# Altium project BTConnecter.PrjPcb
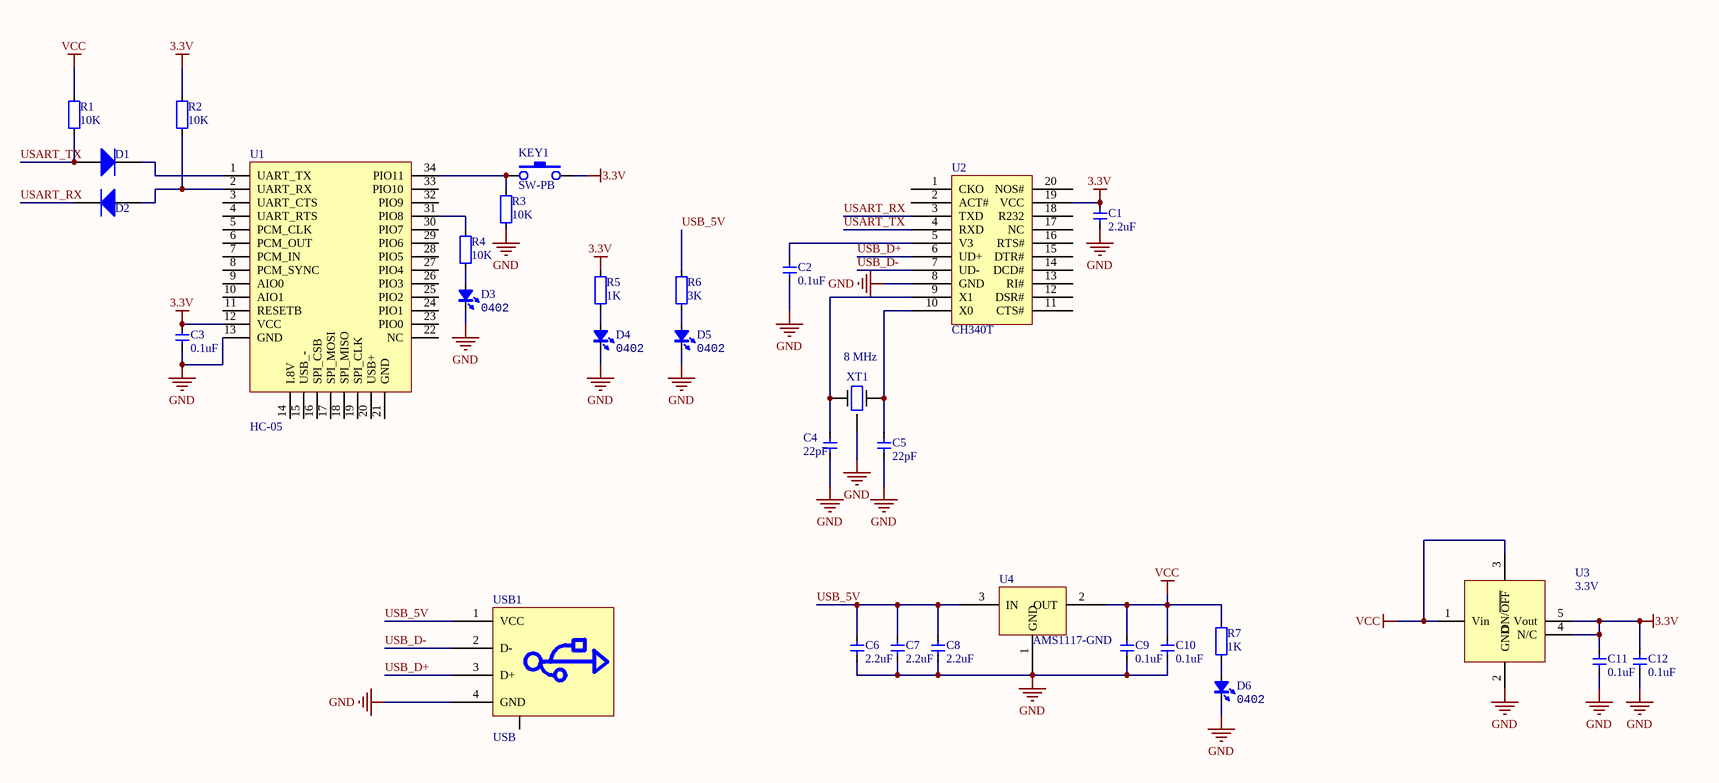
[diagram p0: BTConnecter.SchDoc]
1 sheet, 32 parts. Net scope: global (net labels, ports and power ports of the same name join across sheets).
Board file: BTConnecter.PcbDoc

## Sheet BTConnecter.SchDoc
size A3

### Parts
C1  2.2uF  [CAP_0402]
C2  0.1uF  [CAP_0402]
C3  0.1uF  [CAP_0402]
C4  22pF  [CAP_0402]
C5  22pF  [CAP_0402]
C6  2.2uF  [CAP_0603]
C7  2.2uF  [CAP_0603]
C8  2.2uF  [CAP_0603]
C9  0.1uF  [CAP_0402]
C10  0.1uF  [CAP_0402]
C11  0.1uF  [CAP_0402]
C12  0.1uF  [CAP_0402]
D1  MBR140SFT1G  [DIOM2717X10N]  (value not drawn)
D2  MBR140SFT1G  [DIOM2717X10N]  (value not drawn)
D3  Type: 0402  [LED_0402]  (hidden comment: color?)
D4  Type: 0402  [LED_0402]  (hidden comment: color?)
D5  Type: 0402  [LED_0402]  (hidden comment: color?)
D6  Type: 0402  [LED_0402]  (hidden comment: color?)
KEY1  SW-PB  [ButtonTACT_3x4x2_180H]
R1  10K  [RES_0402]
R2  10K  [RES_0402]
R3  10K  [RES_0402]
R4  10K  [RES_0402]
R5  1K  [RES_0402]
R6  3K  [RES_0402]
R7  1K  [RES_0402]
U1  HC-05  [HC-05/06/08V15]
U2  CH340T  [SSOP-20]
U3  3.3V  [SOT23-5]
U4  AMS1117-GND  [SOT223_JX]
USB1  USB  [USB-plug1]
XT1  8 MHz  [DFN220P320X110-4N]

### Nets
3.3V: C1.2 C3.2 C11.2 C12.2 KEY1.2 R2.2 R5.2 U1.12(VCC) U2.19(VCC) U3.4(N/C) U3.5(Vout)
GND: C1.1 C2.1 C3.1 C4.1 C5.1 C6.1 C7.1 C8.2 C9.1 C10.1 C11.1 C12.1 D3.2(K) D4.2(K) D5.2(K) D6.2(K) R3.1 U1.13(GND) U2.8(GND) U3.2(GND) U4.1(GND) USB1.4(GND) XT1.G
VCC: C9.2 C10.2 R1.2 R7.2 U3.1(Vin) U3.3(ON/~{OFF}) U4.2(OUT)
USART_RX: D2.K U2.3(TXD)
USART_TX: D1.A R1.1 U2.4(RXD)
USB_5V: C6.2 C7.2 C8.1 R6.2 U4.3(IN) USB1.1(VCC)
USB_D+: U2.6(UD+) USB1.3(D+)
USB_D-: U2.7(UD-) USB1.2(D-)
NetC2_2: C2.2 U2.5(V3)
NetC4_2: C4.2 U2.9(X1) XT1.1
NetC5_2: C5.2 U2.10(X0) XT1.3
NetD1_K: D1.K U1.1(UART_TX)
NetD2_A: D2.A R2.1 U1.2(UART_RX)
NetD3_1: D3.1(A) R4.1
NetD4_1: D4.1(A) R5.1
NetD5_1: D5.1(A) R6.1
NetD6_1: D6.1(A) R7.1
NetKEY1_1: KEY1.1 R3.2 U1.34(PIO11)
NetR4_2: R4.2 U1.31(PIO8)

Not connected (* = marked no-connect by the designer): U1 3(UART_CTS) 4(UART_RTS) 5(PCM_CLK) 6(PCM_OUT) 7(PCM_IN) 8(PCM_SYNC) 9(AIO0) 10(AIO1) 11(RESETB) 14(I.8V) 15(USB_-) 16(SPI_CSB) 17(SPI_MOSI) 18(SPI_MISO) 19(SPI_CLK) 20(USB+) 21(GND) 22(NC) 23(PIO0) 24(PIO1) 25(PIO2) 26(PIO3) 27(PIO4) 28(PIO5) 29(PIO6) 30(PIO7) 32(PIO9) 33(PIO10); U2 1(CKO) 2(ACT#) 11(CTS#) 12(DSR#) 13(RI#) 14(DCD#) 15(DTR#) 16(RTS#) 17(NC) 18(R232) 20(NOS#); USB1 0

### Library data of the parts
C1-C5 C9-C12 = 电容-0402: Capacitor; Value: 0.1u
C6-C8 = 电容-0603: Capacitor; Value: 0.1u
D1 D2 = MBR140SFT1G: Rectifier Diode, Single, 40 V, 1 A, SOD-123FL, 2, 550 mV
D3-D6 = LED_0402: LED; Value: color?
KEY1 = KEY
R1-R7 = 电阻-0402: Resistor; Value: 22R
U1 = 蓝牙hc05
U2 = CH340T: Port
U3 = LP5907MFX-3.3/NOPB: IC REG LDO 3.3V 0.25A SOT23-5; Manufacturer: Texas Instruments; Regulator Topology: Positive Fixed; Current - Output: 250mA; Voltage - Input: Up to 5.5V; Supplier 1: Digi-Key; Supplier Part Number 1: 296-38557-1-ND; RoHS: RoHS Compliant; Category: Integrated Circuits (ICs); Stock 1: 39845; Pricing 1: 1=0.57, 10=0.487, 100=0.3634, 500=0.28552, 1000=0.22063 (USD); Packaging: Cut Tape (CT); Part Status: Active; Voltage - Output: 3.3V; Voltage - Dropout (Typical): -; Current - Limit (Min): -; Operating Temperature: -40°C ~ 125°C; Mounting Type: Surface Mount; Package / Case: SC-74A, SOT-753; Supplier Device Package: SOT-23; ComponentLink1URL: http://www.ti.com/lit/ds/symlink/lp5907.pdf; ComponentLink1Description: http://www.ti.com/lit/ds/symlink/lp5907.pdf
U4 = AMS1117-GND: IC
USB1 = USB公头
XT1 = ABM3B-8.000MHZ-10-1-U-T: Crystal 8MHz ±10ppm 10pF 200 Ohm -10°C ~ 60°C Surface Mount 4-SMD, No Lead (DFN, LCC); Manufacturer: Abracon LLC; Operating Mode: Fundamental; Supplier 1: Digi-Key; Supplier Part Number 1: 535-9721-1-ND; RoHS: RoHS Compliant; Category: Crystals, Oscillators, Resonators; Stock: 35437; Pricing 1: 1=0.69, 10=0.578, 50=0.5198, 100=0.462, 500=0.4389 (USD); Packaging: Cut Tape (CT); Part Status: Active; Type: MHz Crystal; Frequency Stability: ±10ppm; Frequency Tolerance: ±10ppm; Load Capacitance: 10pF; Operating Temperature: -10°C ~ 60°C; Ratings: -; Mounting Type: Surface Mount; Package / Case: 4-SMD, No Lead; Size / Dimension: 0.197" L x 0.126" W (5.00mm x 3.20mm); Height - Seated (Max): 0.043" (1.10mm); ComponentLink1URL: http://www.abracon.com/Resonators/abm3b.pdf; ComponentLink1Description: http://www.abracon.com/Resonators/abm3b.pdf; Supplier 2: Digi-Key; Supplier Part Number 2: 535-9721-2-ND; Pricing 2: 1000=0.336, 3000=0.315, 5000=0.3045, 10000=0.294 (USD); Manufacturer Part Number: ABM3B-8.000MHZ-10-1-U-T; Value: 8 MHz